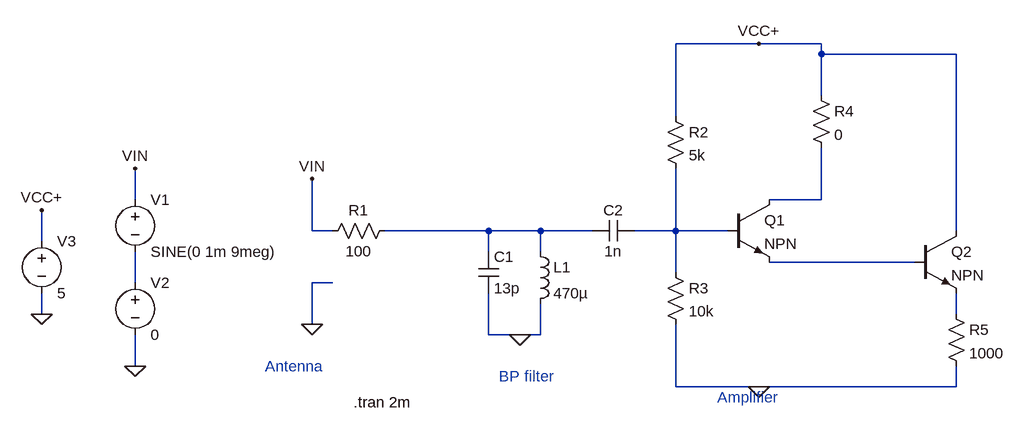
[diagram p0: schematic freq-amp.asc]
freq-amp.asc, the LTspice schematic file:
Version 4
SHEET 1 880 680
WIRE 496 -160 368 -160
WIRE 592 -160 496 -160
WIRE 592 -144 592 -160
WIRE 800 -144 592 -144
WIRE 592 -80 592 -144
WIRE 368 -48 368 -160
WIRE -464 80 -464 32
WIRE 592 80 592 0
WIRE 592 80 512 80
WIRE -192 128 -192 48
WIRE -160 128 -192 128
WIRE 80 128 -80 128
WIRE 160 128 80 128
WIRE 240 128 160 128
WIRE 368 128 368 32
WIRE 368 128 304 128
WIRE 448 128 368 128
WIRE 800 128 800 -144
WIRE -608 144 -608 96
WIRE 80 160 80 128
WIRE 160 160 160 128
WIRE 736 176 512 176
WIRE 368 192 368 128
WIRE -464 208 -464 160
WIRE -160 208 -192 208
WIRE -608 256 -608 224
WIRE 800 256 800 224
WIRE -192 272 -192 208
WIRE 80 288 80 224
WIRE 128 288 80 288
WIRE 160 288 160 240
WIRE 160 288 128 288
WIRE -464 336 -464 288
WIRE 368 368 368 272
WIRE 496 368 368 368
WIRE 800 368 800 336
WIRE 800 368 496 368
FLAG -192 272 0
FLAG 128 288 0
FLAG -608 256 0
FLAG -464 336 0
FLAG 496 368 0
FLAG -608 96 VCC+
FLAG 496 -160 VCC+
FLAG -464 32 VIN
FLAG -192 48 VIN
SYMBOL cap 64 160 R0
SYMATTR InstName C1
SYMATTR Value 13p
SYMBOL ind 144 144 R0
SYMATTR InstName L1
SYMATTR Value 470µ
SYMBOL res -64 112 R90
WINDOW 0 0 56 VBottom 2
WINDOW 3 32 56 VTop 2
SYMATTR InstName R1
SYMATTR Value 100
SYMBOL voltage -464 64 R0
WINDOW 123 0 0 Left 0
WINDOW 39 0 0 Left 0
SYMATTR InstName V1
SYMATTR Value SINE(0 1m 9meg)
SYMBOL voltage -464 192 R0
WINDOW 123 0 0 Left 0
WINDOW 39 0 0 Left 0
SYMATTR InstName V2
SYMATTR Value 0
SYMBOL res 352 -64 R0
SYMATTR InstName R2
SYMATTR Value 5k
SYMBOL res 352 176 R0
SYMATTR InstName R3
SYMATTR Value 10k
SYMBOL cap 304 112 R90
WINDOW 0 0 32 VBottom 2
WINDOW 3 32 32 VTop 2
SYMATTR InstName C2
SYMATTR Value 1n
SYMBOL npn 448 80 R0
SYMATTR InstName Q1
SYMBOL voltage -608 128 R0
WINDOW 123 0 0 Left 0
WINDOW 39 0 0 Left 0
SYMATTR InstName V3
SYMATTR Value 5
SYMBOL npn 736 128 R0
SYMATTR InstName Q2
SYMBOL res 576 -96 R0
SYMATTR InstName R4
SYMATTR Value 0
SYMBOL res 784 240 R0
SYMATTR InstName R5
SYMATTR Value 1000
TEXT -264 336 Left 2 ;Antenna
TEXT 96 352 Left 2 ;BP filter
TEXT 432 384 Left 2 ;Amplifier
TEXT -128 392 Left 2 !.tran 2m

The netlist it stands for:
* freq-amp.asc
C1 N002 0 13p
L1 N002 0 470µ
R1 N002 VIN 100
V1 VIN N005 SINE(0 1m 9meg)
V2 N005 0 0
R2 VCC+ N003 5k
R3 N003 0 10k
C2 N003 N002 1n
Q1 N001 N003 N004 0 NPN
V3 VCC+ 0 5
Q2 VCC+ N004 N006 0 NPN
R4 VCC+ N001 0
R5 N006 0 1000
.model NPN NPN
.model PNP PNP
.lib standard.bjt
* Antenna
* BP filter
* Amplifier
.tran 2m
.backanno
.end